# Altium schematic sheet altium-template.schdoc
size A3; Organization: Altium Limited; Address1: L3, 12a Rodborough Rd; Address2: Frenchs Forest; Address3: NSW; Address4: Australia 2086; SheetTotal: 1
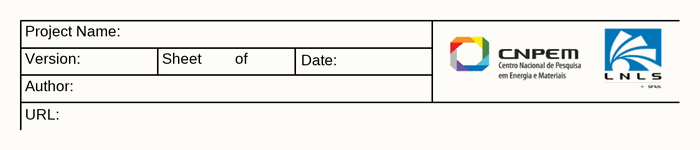
[diagram p0: altium-template.schdoc]

## Notes on the sheet
- Project Name:
- Version:
- Author:
- Sheet
- of
- Date:
- URL:
- Title
- Size:
- A3
- Number:
- Time:
- Revision:
- File: